# Altium schematic sheet USB_To_TTL.SchDoc: BluetoothGateway
size A3; DrawnBy: Q.Thang & T.Khoa; Revision: V1.0.0; SheetNumber: 17; SheetTotal: 17
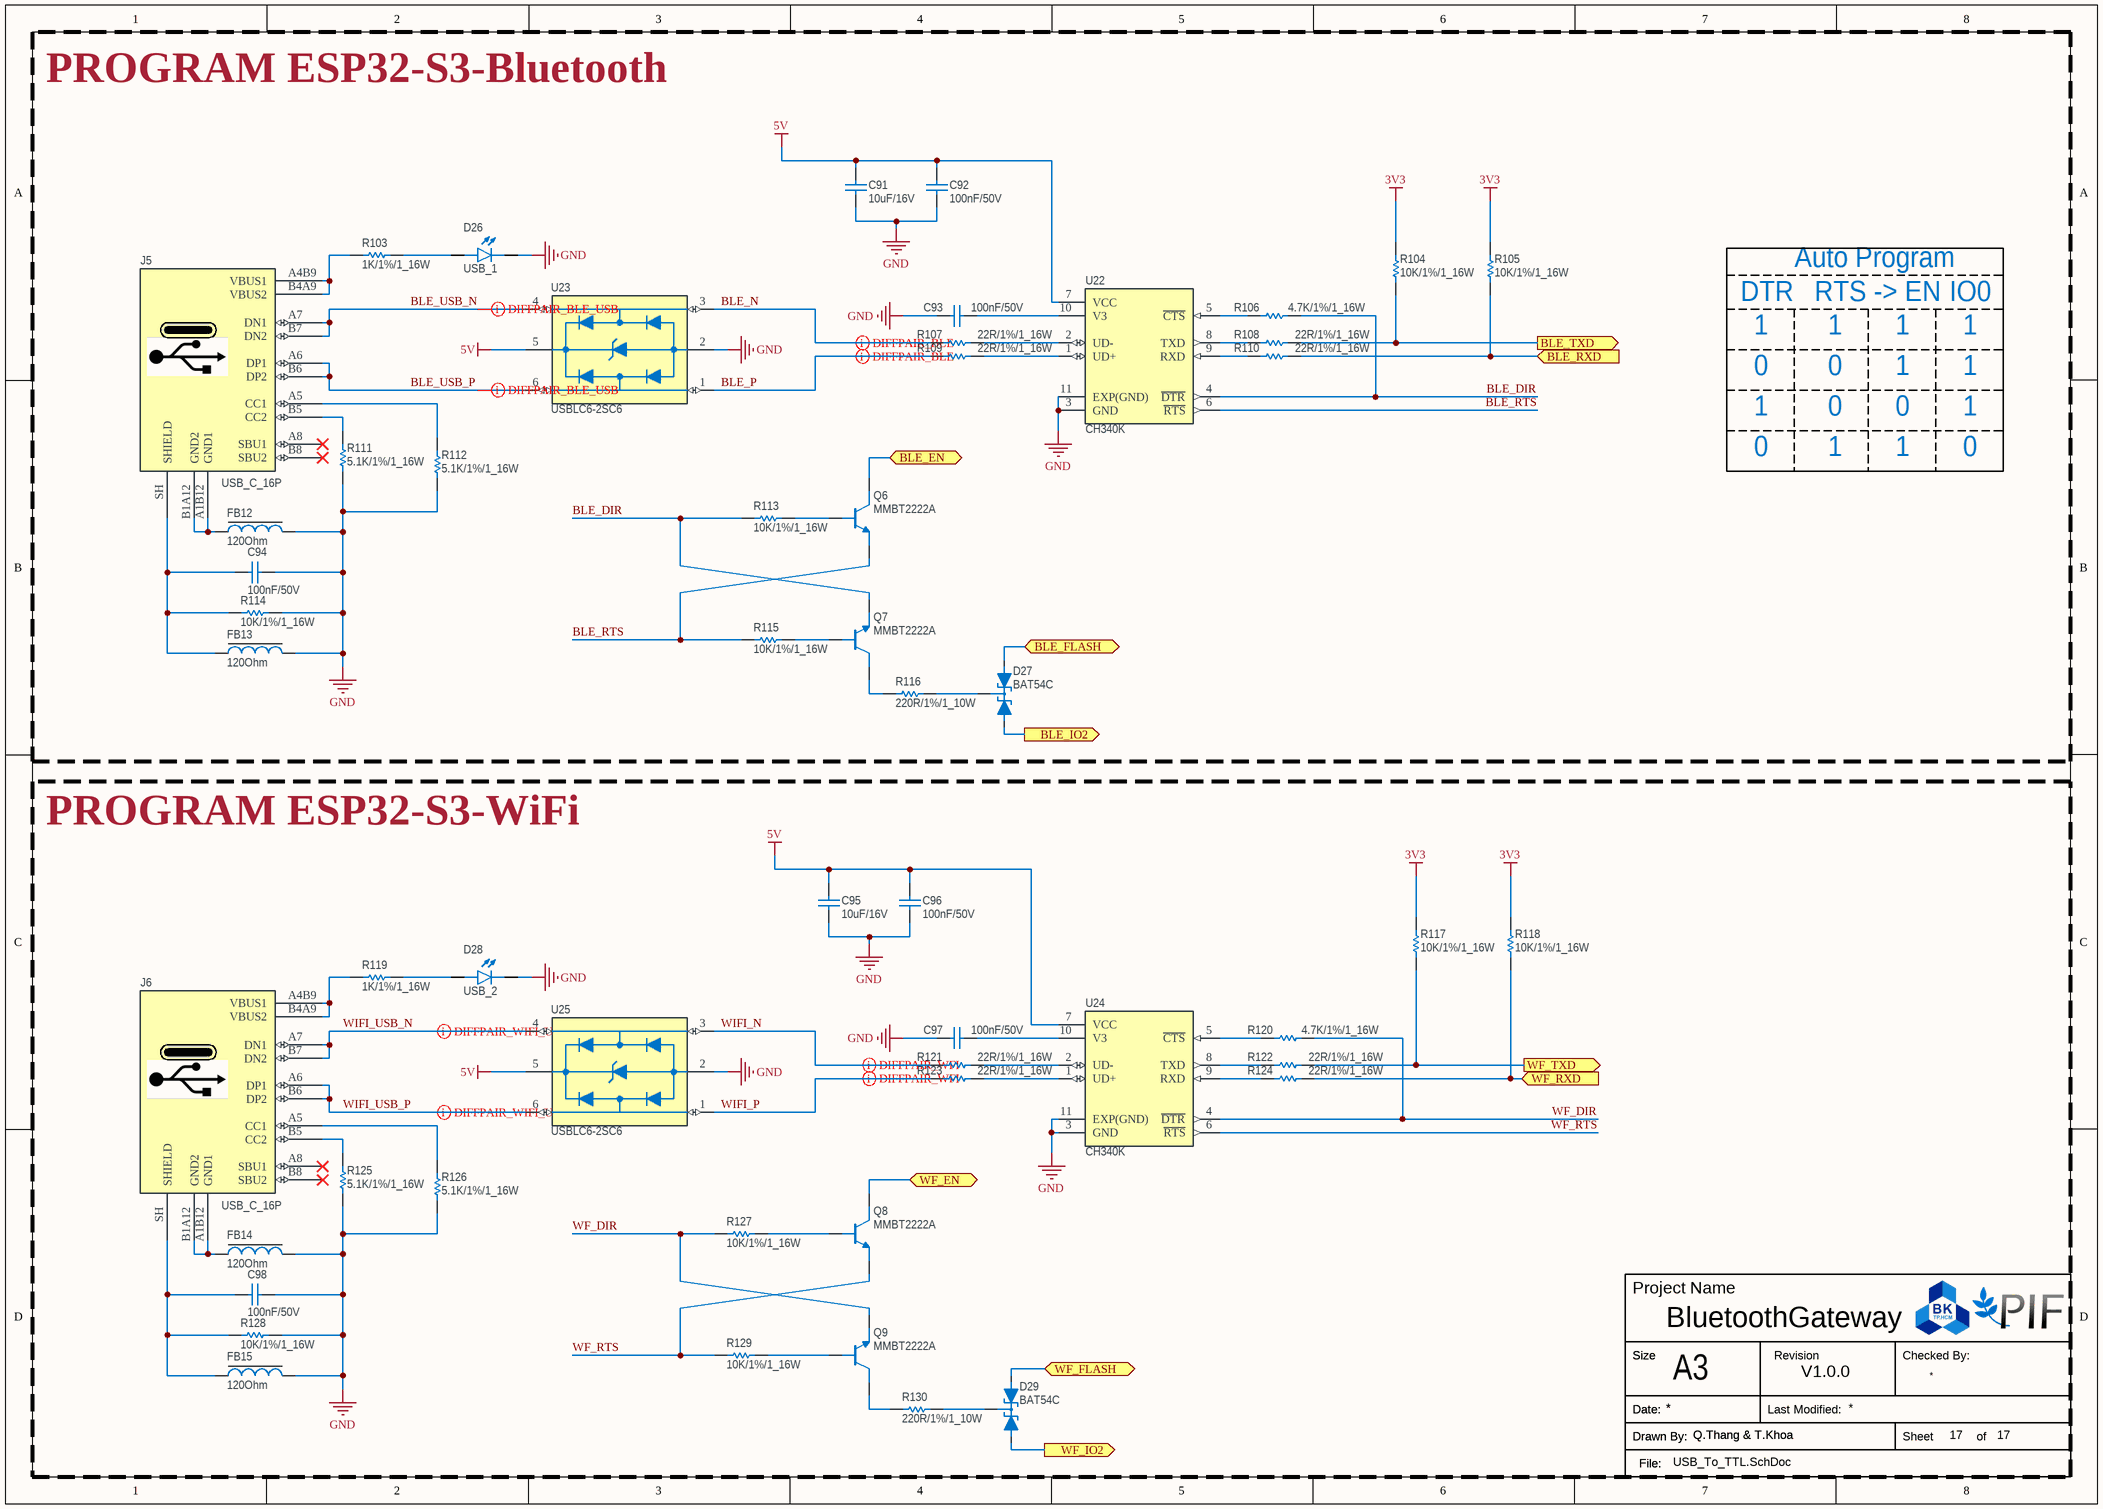
[diagram p0: USB_To_TTL.SchDoc]

## Parts
C91  10uF/16V  [CAP_0603]
C92  100nF/50V  [CAP_0603]
C93  100nF/50V  [CAP_0402]
C94  100nF/50V  [CAP_0402]
C95  10uF/16V  [CAP_0603]
C96  100nF/50V  [CAP_0603]
C97  100nF/50V  [CAP_0402]
C98  100nF/50V  [CAP_0402]
D26  USB_1  [LED_0603Y]
D27  BAT54C  [SOT-23]
D28  USB_2  [LED_0603Y]
D29  BAT54C  [SOT-23]
FB12  120Ohm  [Ferrite_Bead_0805]
FB13  120Ohm  [Ferrite_Bead_0805]
FB14  120Ohm  [Ferrite_Bead_0805]
FB15  120Ohm  [Ferrite_Bead_0805]
J5  USB_C_16P  [USB_TypeC_3.1]
J6  USB_C_16P  [USB_TypeC_3.1]
Q6  MMBT2222A  [SOT-23]
Q7  MMBT2222A  [SOT-23]
Q8  MMBT2222A  [SOT-23]
Q9  MMBT2222A  [SOT-23]
R103  1K/1%/1_16W  [RESISTOR_0402]
R104  10K/1%/1_16W  [RESISTOR_0402]
R105  10K/1%/1_16W  [RESISTOR_0402]
R106  4.7K/1%/1_16W  [RESISTOR_0402]
R107  22R/1%/1_16W  [RESISTOR_0402]
R108  22R/1%/1_16W  [RESISTOR_0402]
R109  22R/1%/1_16W  [RESISTOR_0402]
R110  22R/1%/1_16W  [RESISTOR_0402]
R111  5.1K/1%/1_16W  [RESISTOR_0402]
R112  5.1K/1%/1_16W  [RESISTOR_0402]
R113  10K/1%/1_16W  [RESISTOR_0402]
R114  10K/1%/1_16W  [RESISTOR_0402]
R115  10K/1%/1_16W  [RESISTOR_0402]
R116  220R/1%/1_10W  [Resistor_0603]
R117  10K/1%/1_16W  [RESISTOR_0402]
R118  10K/1%/1_16W  [RESISTOR_0402]
R119  1K/1%/1_16W  [RESISTOR_0402]
R120  4.7K/1%/1_16W  [RESISTOR_0402]
R121  22R/1%/1_16W  [RESISTOR_0402]
R122  22R/1%/1_16W  [RESISTOR_0402]
R123  22R/1%/1_16W  [RESISTOR_0402]
R124  22R/1%/1_16W  [RESISTOR_0402]
R125  5.1K/1%/1_16W  [RESISTOR_0402]
R126  5.1K/1%/1_16W  [RESISTOR_0402]
R127  10K/1%/1_16W  [RESISTOR_0402]
R128  10K/1%/1_16W  [RESISTOR_0402]
R129  10K/1%/1_16W  [RESISTOR_0402]
R130  220R/1%/1_10W  [Resistor_0603]
U22  CH340K  [EESOP10]
U23  USBLC6-2SC6  [SOT-23-6]
U24  CH340K  [EESOP10]
U25  USBLC6-2SC6  [SOT-23-6]

## Blocks framed on the sheet
PROGRAM ESP32-S3-Bluetooth: C91-C94 D26 D27 FB12 FB13 J5 Q6 Q7 R103-R116 U22 U23
PROGRAM ESP32-S3-WiFi: C95-C98 D28 D29 FB14 FB15 J6 Q8 Q9 R117-R130 U24 U25

## Ports
BLE_EN (bidir, see Overview_Schematic[3A], ESP32_BLE[1D], ESP32_BLE[2A]), BLE_FLASH (bidir, see Overview_Schematic[4A], ESP32_BLE[1D], ESP32_BLE[2B]), BLE_IO2 (out, see Overview_Schematic[3A], ESP32_BLE[2B]), BLE_RXD (in, see Overview_Schematic[3A], ESP32_BLE[2B]), BLE_TXD (out, see Overview_Schematic[3A], ESP32_BLE[2A]), WF_EN (bidir, see Overview_Schematic[5A], ESP32_WiFi[1C], ESP32_WiFi[2A]), WF_FLASH (bidir, see Overview_Schematic[5A], ESP32_WiFi[1C], ESP32_WiFi[2A]), WF_IO2 (out, see Overview_Schematic[5A], ESP32_WiFi[2B]), WF_RXD (in, see Overview_Schematic[5A], ESP32_WiFi[2A]), WF_TXD (out, see Overview_Schematic[5A], ESP32_WiFi[2A])

## Nets
3V3: R104.2 R105.2 R117.2 R118.2
5V: C91.2 C92.2 C95.2 C96.2 U22.7(VCC) U23.5(VBUS) U24.7(VCC) U25.5(VBUS)
GND: C91.1 C92.1 C93.1 C94.2 C95.1 C96.1 C97.1 C98.2 D26.C D28.C FB12.2 FB13.2 FB14.2 FB15.2 R111.1 R112.1 R114.2 R125.1 R126.1 R128.2 U22.3(GND) U22.11(EXP(GND)) U23.2(GND) U24.3(GND) U24.11(EXP(GND)) U25.2(GND)
BLE_DIR: Q7.2(E) R106.2 R113.1 U22.4(~{DTR})
BLE_EN: Q6.3(C) ; port BLE_EN
BLE_FLASH: D27.2(A2) ; port BLE_FLASH
BLE_IO2: D27.1(A1) ; port BLE_IO2
BLE_N: R107.1 U23.3(I/O2_IN)
BLE_P: R109.1 U23.1(I/O1_IN)
BLE_RTS: Q6.2(E) R115.1 U22.6(~{RTS})
BLE_RXD: R105.1 R110.2 ; port BLE_RXD
BLE_TXD: R104.1 R108.2 ; port BLE_TXD
BLE_USB_N: J5.A7(DN1) J5.B7(DN2) U23.4(I/O2_OUT)
BLE_USB_P: J5.A6(DP1) J5.B6(DP2) U23.6(I/O1_OUT)
WF_DIR: Q9.2(E) R120.2 R127.1 U24.4(~{DTR})
WF_EN: Q8.3(C) ; port WF_EN
WF_FLASH: D29.2(A2) ; port WF_FLASH
WF_IO2: D29.1(A1) ; port WF_IO2
WF_RTS: Q8.2(E) R129.1 U24.6(~{RTS})
WF_RXD: R118.1 R124.2 ; port WF_RXD
WF_TXD: R117.1 R122.2 ; port WF_TXD
WIFI_N: R121.1 U25.3(I/O2_IN)
WIFI_P: R123.1 U25.1(I/O1_IN)
WIFI_USB_N: J6.A7(DN1) J6.B7(DN2) U25.4(I/O2_OUT)
WIFI_USB_P: J6.A6(DP1) J6.B6(DP2) U25.6(I/O1_OUT)
NetC93_2: C93.2 U22.10(V3)
NetC94_1: C94.1 FB13.1 J5.SH(SHIELD) R114.1
NetC97_2: C97.2 U24.10(V3)
NetC98_1: C98.1 FB15.1 J6.SH(SHIELD) R128.1
NetD26_A: D26.A R103.2
NetD27_3: D27.3(C) R116.2
NetD28_A: D28.A R119.2
NetD29_3: D29.3(C) R130.2
NetFB12_1: FB12.1 J5.A1B12(GND1) J5.B1A12(GND2)
NetFB14_1: FB14.1 J6.A1B12(GND1) J6.B1A12(GND2)
NetJ5_A4B9: J5.A4B9(VBUS1) J5.B4A9(VBUS2) R103.1
NetJ5_A5: J5.A5(CC1) R112.2
NetJ5_B5: J5.B5(CC2) R111.2
NetJ6_A4B9: J6.A4B9(VBUS1) J6.B4A9(VBUS2) R119.1
NetJ6_A5: J6.A5(CC1) R126.2
NetJ6_B5: J6.B5(CC2) R125.2
NetQ6_1: Q6.1(B) R113.2
NetQ7_1: Q7.1(B) R115.2
NetQ7_3: Q7.3(C) R116.1
NetQ8_1: Q8.1(B) R127.2
NetQ9_1: Q9.1(B) R129.2
NetQ9_3: Q9.3(C) R130.1
NetR106_1: R106.1 U22.5(~{CTS})
NetR107_2: R107.2 U22.2(UD-)
NetR108_1: R108.1 U22.8(TXD)
NetR109_2: R109.2 U22.1(UD+)
NetR110_1: R110.1 U22.9(RXD)
NetR120_1: R120.1 U24.5(~{CTS})
NetR121_2: R121.2 U24.2(UD-)
NetR122_1: R122.1 U24.8(TXD)
NetR123_2: R123.2 U24.1(UD+)
NetR124_1: R124.1 U24.9(RXD)

Not connected (* = marked no-connect by the designer): J5 A8(SBU1)* B8(SBU2)*; J6 A8(SBU1)* B8(SBU2)*

## Layout directives
differential pair: BLE_N, BLE_P, BLE_USB_N, BLE_USB_P, WIFI_N, WIFI_P, WIFI_USB_N, WIFI_USB_P

## Notes on the sheet
- DTR
- Auto Program
- RTS -> EN
- IO0
- 1
- 0
- Project Name
- Size
- A3
- Revision
- Checked By:
- Drawn By:
- Date:
- File:
- Last Modified:
- Sheet
- of

## Library data of the parts
C91 C95 = Ceramic_Cap_10uF_16V_0603: CAP, size 0603, 10uF, 16V; Supply Part Number: Tụ Gốm 0603 10uF 16V; Supply Name: Thegioiic; Datasheet: *; Supply URL: https://www.thegioiic.com/tu-gom-0603-10uf-16v
C92 C96 = Ceramic_Cap_100nF_50V_0603: CAP, size 0603, 100nF, 50V; Supply Part Number: Tụ Gốm 0603 100nF (0.1uF) 50V; Supply Name: Thegioiic; Datasheet: *; Supply URL: https://www.thegioiic.com/tu-gom-0603-100nf-0-1uf-50v
C93 C94 C97 C98 = Ceramic_Cap_100nF_50V_0402: CAP, size 0402, 100nF, 50V; Supply Part Number: Tụ Gốm 0402 100nF (0.1uF) 50V; Supply Name: Thegioiic; Datasheet: *; Supply URL: https://www.thegioiic.com/tu-gom-0402-100nf-0-1uf-50v
D26 D28 = LED_Yellow_0603: LED Yellow 0603; Supply Part Number: LED Vàng 0603 Dán SMD Trong Suốt Harvatek; Supply Name: Thegioiic; Supply URL: https://www.thegioiic.com/led-vang-0603-dan-smd-trong-suot-harvatek
D27 D29 = BAT54C: DIODE ARRAY SCHOTTKY 30V SOT23-3; Supply Name: Thegioiic; Datasheet: https://www.alldatasheet.com/datasheet-pdf/view/527995/NXP/BAT54C.html; Supply Part Number: BAT54C; Supply URL: https://www.thegioiic.com/bat54c
FB12-FB15 = Ferrite_Bead_120Ohm_2A_0805: Ferrite Bead, size 0805, 120Ohm, 2A; Supply Part Number: CBW201209U121T Ferrite Beads 2A 120 Ohm 0805; Supply Name: Thegioiic; Supply URL: https://www.thegioiic.com/cbw201209u121t-ferrite-beads-2a-120-ohm-0805
J5 J6 = USB_TypeC_3.1: USB Type C - Connector, Top-mount SMT, 16pos | Molex Incorporated 217179-0001; Supply Part Number: Cổng USB Cái 3.1 Type C 16 Chân Thẳng Dán SMD; Supply Name: Thegioiic; Datasheet: https://www.thegioiic.com/upload/documents/1734591720_TYPE-C-16PIN.pdf; Supply URL: https://www.thegioiic.com/cong-usb-cai-3-1-type-c-16-chan-thang-dan-smd
Q6-Q9 = MMBT2222A: Điện áp Vce max: 40V, dòng Ic max: 0.6A, công suất: 0.3W; Supply Part Number: MMBT2222A 1P Transistor NPN 40V 0.6A 3 Chân SOT-23; Supply Name: Thegioiic; Datasheet: https://www.thegioiic.com/upload/documents/1734592311_MMBT2222A.pdf; Supply URL: https://www.thegioiic.com/mmbt2222a-1p-transistor-npn-40v-0-6a-3-chan-sot-23
R103 R119 = Res_1K_0402_1%: Resistor 0402 1KOhm 1% 1_16W; Supply Part Number: Điện Trở 1 KOhm 0402 1%; Supply Name: Thegioiic; Supply URL: https://www.thegioiic.com/dien-tro-1-kohm-0402-1-
R104 R105 R113-R115 R117 R118 R127-R129 = Res_10K_0402_1%: Resistor 0402 10KOhm 1% 1_16W; Supply Part Number: Điện Trở 10 KOhm 0402 1%; Supply Name: Thegioiic; Supply URL: https://www.thegioiic.com/dien-tro-10-kohm-0402-1-
R106 R120 = Res_4.7K_0402_1%: Resistor 0402 4.7KOhm 1% 1_16W; Supply Part Number: Điện Trở 4.7 KOhm 0402 1%; Supply Name: Thegioiic; Supply URL: https://www.thegioiic.com/dien-tro-4-7-kohm-0402-1-
R107-R110 R121-R124 = Res_22R_0402_1%: Resistor 0402 22 Ohm 1% 1_16W; Supply Name: *; Supply Part Number: *; Supply URL: *
R111 R112 R125 R126 = Res_5.1K_0402_1%: Resistor 0402 5.1KOhm 1% 1_16W; Supply Name: *; Supply Part Number: *; Supply URL: *
R116 R130 = Res_220R_0603_1%: Resistor 0603 220 Ohm 1% 1_10W; Supply Part Number: Điện Trở 220 Ohm 0603 1%; Supply Name: Thegioiic; Supply URL: https://www.thegioiic.com/dien-tro-220-ohm-0603-1-
U22 U24 = CH340K: USB to Serial Port Chip; Supply Name: LinhKienThuDuc; Datasheet: https://www.alldatasheet.com/datasheet-pdf/view/1817211/WCH/CH340K.html; Supply Part Number: CH340K; Supply URL: https://linhkienthuduc.com/san-pham/ch340k/
U23 U25 = USBLC6-2SC6: 17V Clamp 5A (8/20Âµs) Ipp Tvs Diode Surface Mount SOT-23-6; Supply Part Number: USBLC6-2SC6 TVS diode 5.25V 17V SOT23-6; Supply Name: Icdayroi; Datasheet: https://www.alldatasheet.com/datasheet-pdf/view/111891/STMICROELECTRONICS/USBLC6-2SC6.html; Supply URL: https://icdayroi.com/usblc6-2sc6-tvs-diode-5-25v-17v-sot23-6